# Altium schematic sheet v3s.SchDoc
size B
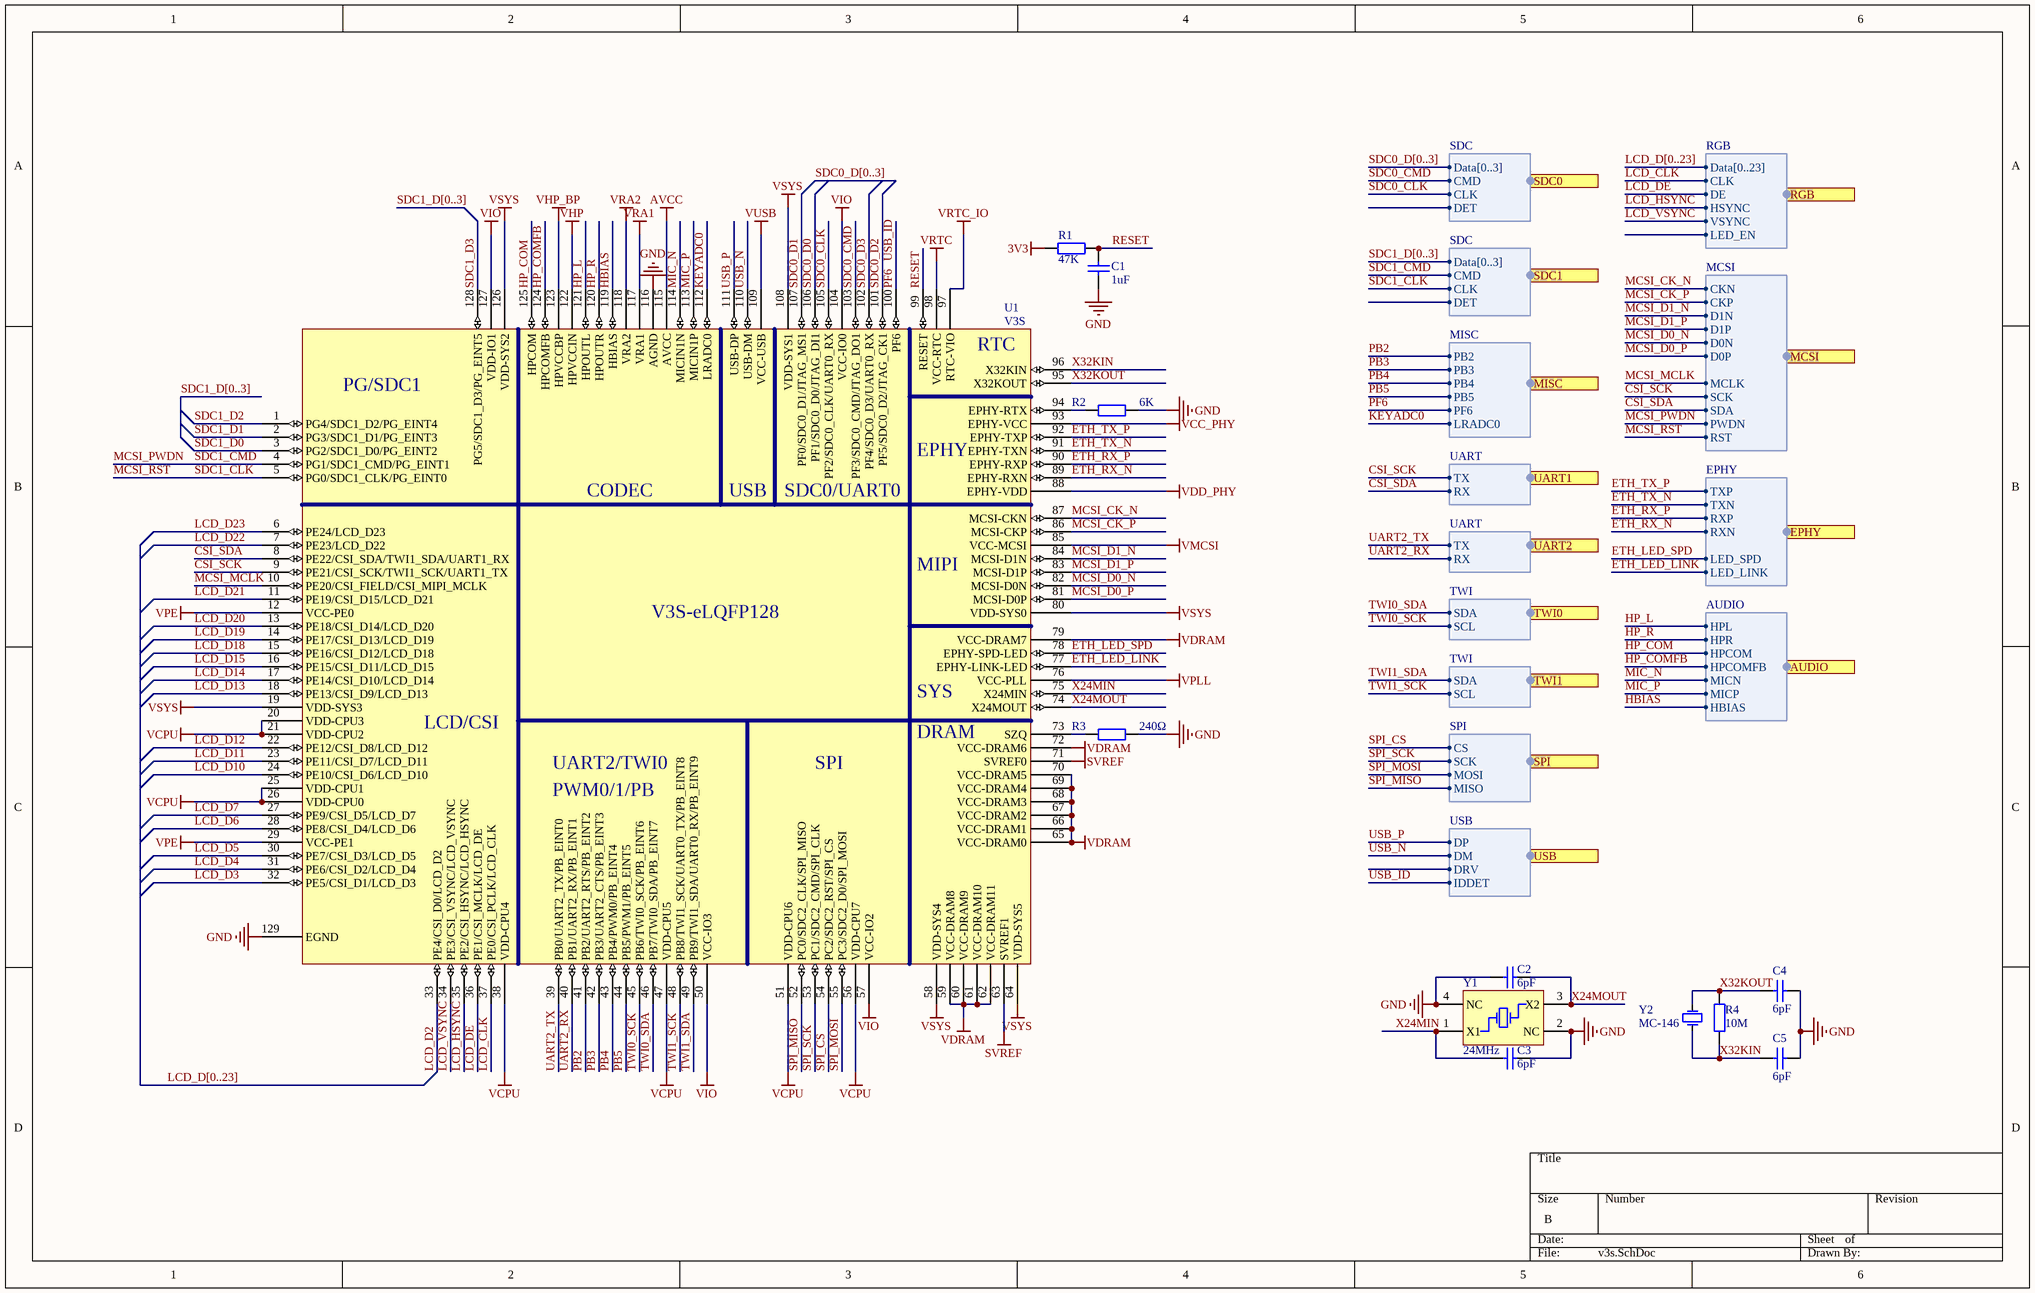
[diagram p0: v3s.SchDoc]

## Parts
C1  1uF  [CAPC1608L]
C2  6pF  [CAPC1608L]
C3  6pF  [CAPC1608L]
C4  6pF  [CAPC1608L]
C5  6pF  [CAPC1608L]
R1  47K  [RESC1608L]
R2  6K  [RESC1608L]
R3  240Ω  [RESC1608L]
R4  10M  [RESC1608L]
U1  V3S  [V3S_L]
Y1  24MHz  [XTAL-3225]
Y2  MC-146  [MC-146]

## Ports
AUDIO (harness AUDIO), EPHY (harness EPHY), MCSI (harness MCSI), MISC (harness MISC), RGB (harness RGB), SDC0 (harness SDC), SDC1 (harness SDC), SPI (harness SPI), TWI0 (harness TWI), TWI1 (harness TWI), UART1 (harness UART), UART2 (harness UART), USB (harness USB)

## Harnesses
SDC: Data[0..3], CMD, CLK, DET
UART: TX, RX
TWI: SDA, SCL
SPI: CS, SCK, MOSI, MISO
USB: DP, DM, DRV, IDDET
RGB: Data[0..23], CLK, DE, HSYNC, VSYNC, LED_EN
MCSI: CKN, CKP, D1N, D1P, D0N, D0P, MCLK, SCK, SDA, PWDN, RST
EPHY: TXP, TXN, RXP, RXN, LED_SPD, LED_LINK
AUDIO: HPL, HPR, HPCOM, HPCOMFB, MICP, HBIAS, MICN
MISC: PB2, PB3, PB4, PB5, LRADC0, PF6

## Nets
3V3: R1.1
AVCC: U1.115(AVCC)
GND: C1.1 C2.1 C3.2 C4.2 C5.2 R2.1 R3.1 U1.116(AGND) U1.129(EGND) Y1.2(NC) Y1.4(NC)
SVREF: U1.63(SVREF1) U1.71(SVREF0)
VCC_PHY: U1.93(EPHY-VCC)
VCPU: U1.20(VDD-CPU3) U1.21(VDD-CPU2) U1.25(VDD-CPU1) U1.26(VDD-CPU0) U1.38(VDD-CPU4) U1.47(VDD-CPU5) U1.51(VDD-CPU6) U1.56(VDD-CPU7)
VDD_PHY: U1.88(EPHY-VDD)
VDRAM: U1.59(VCC-DRAM8) U1.60(VCC-DRAM9) U1.61(VCC-DRAM10) U1.62(VCC-DRAM11) U1.65(VCC-DRAM0) U1.66(VCC-DRAM1) U1.67(VCC-DRAM2) U1.68(VCC-DRAM3) U1.69(VCC-DRAM4) U1.70(VCC-DRAM5) U1.72(VCC-DRAM6) U1.79(VCC-DRAM7)
VHP: U1.122(HPVCCIN)
VHP_BP: U1.123(HPVCCBP)
VIO: U1.50(VCC-IO3) U1.57(VCC-IO2) U1.104(VCC-IO0) U1.127(VDD-IO1)
VMCSI: U1.85(VCC-MCSI)
VPE: U1.12(VCC-PE0) U1.29(VCC-PE1)
VPLL: U1.76(VCC-PLL)
VRA1: U1.117(VRA1)
VRA2: U1.118(VRA2)
VRTC: U1.98(VCC-RTC)
VRTC_IO: U1.97(RTC-VIO)
VSYS: U1.19(VDD-SYS3) U1.58(VDD-SYS4) U1.64(VDD-SYS5) U1.80(VDD-SYS0) U1.108(VDD-SYS1) U1.126(VDD-SYS2)
VUSB: U1.109(VCC-USB)
CSI_SCK: U1.9(PE21/CSI_SCK/TWI1_SCK/UART1_TX) ; port UART1.TX, port MCSI.SCK
CSI_SDA: U1.8(PE22/CSI_SDA/TWI1_SDA/UART1_RX) ; port UART1.RX, port MCSI.SDA
ETH_LED_LINK: U1.77(EPHY-LINK-LED) ; port EPHY.LED_LINK
ETH_LED_SPD: U1.78(EPHY-SPD-LED) ; port EPHY.LED_SPD
ETH_RX_N: U1.89(EPHY-RXN) ; port EPHY.RXN
ETH_RX_P: U1.90(EPHY-RXP) ; port EPHY.RXP
ETH_TX_N: U1.91(EPHY-TXN) ; port EPHY.TXN
ETH_TX_P: U1.92(EPHY-TXP) ; port EPHY.TXP
HBIAS: U1.119(HBIAS) ; port AUDIO.HBIAS
HP_COM: U1.125(HPCOM) ; port AUDIO.HPCOM
HP_COMFB: U1.124(HPCOMFB) ; port AUDIO.HPCOMFB
HP_L: U1.121(HPOUTL) ; port AUDIO.HPL
HP_R: U1.120(HPOUTR) ; port AUDIO.HPR
KEYADC0: U1.112(LRADC0) ; port MISC.LRADC0
LCD_CLK: U1.37(PE0/CSI_PCLK/LCD_CLK) ; port RGB.CLK
LCD_D2: U1.33(PE4/CSI_D0/LCD_D2)
LCD_D3: U1.32(PE5/CSI_D1/LCD_D3)
LCD_D4: U1.31(PE6/CSI_D2/LCD_D4)
LCD_D5: U1.30(PE7/CSI_D3/LCD_D5)
LCD_D6: U1.28(PE8/CSI_D4/LCD_D6)
LCD_D7: U1.27(PE9/CSI_D5/LCD_D7)
LCD_D10: U1.24(PE10/CSI_D6/LCD_D10)
LCD_D11: U1.23(PE11/CSI_D7/LCD_D11)
LCD_D12: U1.22(PE12/CSI_D8/LCD_D12)
LCD_D13: U1.18(PE13/CSI_D9/LCD_D13)
LCD_D14: U1.17(PE14/CSI_D10/LCD_D14)
LCD_D15: U1.16(PE15/CSI_D11/LCD_D15)
LCD_D18: U1.15(PE16/CSI_D12/LCD_D18)
LCD_D19: U1.14(PE17/CSI_D13/LCD_D19)
LCD_D20: U1.13(PE18/CSI_D14/LCD_D20)
LCD_D21: U1.11(PE19/CSI_D15/LCD_D21)
LCD_D22: U1.7(PE23/LCD_D22)
LCD_D23: U1.6(PE24/LCD_D23)
LCD_DE: U1.36(PE1/CSI_MCLK/LCD_DE) ; port RGB.DE
LCD_HSYNC: U1.35(PE2/CSI_HSYNC/LCD_HSYNC) ; port RGB.HSYNC
LCD_VSYNC: U1.34(PE3/CSI_VSYNC/LCD_VSYNC) ; port RGB.VSYNC
MCSI_CK_N: U1.87(MCSI-CKN) ; port MCSI.CKN
MCSI_CK_P: U1.86(MCSI-CKP) ; port MCSI.CKP
MCSI_D0_N: U1.82(MCSI-D0N) ; port MCSI.D0N
MCSI_D0_P: U1.81(MCSI-D0P) ; port MCSI.D0P
MCSI_D1_N: U1.84(MCSI-D1N) ; port MCSI.D1N
MCSI_D1_P: U1.83(MCSI-D1P) ; port MCSI.D1P
MCSI_MCLK: U1.10(PE20/CSI_FIELD/CSI_MIPI_MCLK) ; port MCSI.MCLK
MCSI_PWDN: U1.4(PG1/SDC1_CMD/PG_EINT1) ; port SDC1.CMD, port MCSI.PWDN  [also labelled SDC1_CMD]
MCSI_RST: U1.5(PG0/SDC1_CLK/PG_EINT0) ; port SDC1.CLK, port MCSI.RST  [also labelled SDC1_CLK]
MIC_N: U1.114(MICIN1N) ; port AUDIO.MICN
MIC_P: U1.113(MICIN1P) ; port AUDIO.MICP
PB2: U1.41(PB2/UART2_RTS/PB_EINT2) ; port MISC.PB2
PB3: U1.42(PB3/UART2_CTS/PB_EINT3) ; port MISC.PB3
PB4: U1.43(PB4/PWM0/PB_EINT4) ; port MISC.PB4
PB5: U1.44(PB5/PWM1/PB_EINT5) ; port MISC.PB5
PF6: U1.100(PF6) ; port USB.IDDET, port MISC.PF6  [also labelled USB_ID]
RESET: C1.2 R1.2 U1.99(RESET)
SDC0_CLK: U1.105(PF2/SDC0_CLK/UART0_RX) ; port SDC0.CLK
SDC0_CMD: U1.103(PF3/SDC0_CMD/JTAG_DO1) ; port SDC0.CMD
SDC0_D0: U1.106(PF1/SDC0_D0/JTAG_DI1)
SDC0_D1: U1.107(PF0/SDC0_D1/JTAG_MS1)
SDC0_D2: U1.101(PF5/SDC0_D2/JTAG_CK1)
SDC0_D3: U1.102(PF4/SDC0_D3/UART0_RX)
SDC1_D0: U1.3(PG2/SDC1_D0/PG_EINT2)
SDC1_D1: U1.2(PG3/SDC1_D1/PG_EINT3)
SDC1_D2: U1.1(PG4/SDC1_D2/PG_EINT4)
SDC1_D3: U1.128(PG5/SDC1_D3/PG_EINT5)
SPI_CS: U1.54(PC2/SDC2_RST/SPI_CS) ; port SPI.CS
SPI_MISO: U1.52(PC0/SDC2_CLK/SPI_MISO) ; port SPI.MISO
SPI_MOSI: U1.55(PC3/SDC2_D0/SPI_MOSI) ; port SPI.MOSI
SPI_SCK: U1.53(PC1/SDC2_CMD/SPI_CLK) ; port SPI.SCK
TWI0_SCK: U1.45(PB6/TWI0_SCK/PB_EINT6) ; port TWI0.SCL
TWI0_SDA: U1.46(PB7/TWI0_SDA/PB_EINT7) ; port TWI0.SDA
TWI1_SCK: U1.48(PB8/TWI1_SCK/UART0_TX/PB_EINT8) ; port TWI1.SCL
TWI1_SDA: U1.49(PB9/TWI1_SDA/UART0_RX/PB_EINT9) ; port TWI1.SDA
UART2_RX: U1.40(PB1/UART2_RX/PB_EINT1) ; port UART2.RX
UART2_TX: U1.39(PB0/UART2_TX/PB_EINT0) ; port UART2.TX
USB_N: U1.110(USB-DM) ; port USB.DM
USB_P: U1.111(USB-DP) ; port USB.DP
X24MIN: C3.1 U1.75(X24MIN) Y1.1(X1)
X24MOUT: C2.2 U1.74(X24MOUT) Y1.3(X2)
X32KIN: C5.1 R4.1 U1.96(X32KIN) Y2.2(OSC2)
X32KOUT: C4.1 R4.2 U1.95(X32KOUT) Y2.1(OSC1)
NetR2_2: R2.2 U1.94(EPHY-RTX)
NetR3_2: R3.2 U1.73(SZQ)

## Buses and harness runs
bus LCD_D[0..23]
bus SDC0_D[0..3]
bus SDC1_D[0..3]

## Notes on the sheet
- (in symbol V3S) RTC; PG/SDC1; EPHY; CODEC; USB; SDC0/UART0; MIPI; V3S-eLQFP128; SYS; LCD/CSI; DRAM; UART2/TWI0; SPI; PWM0/1/PB

## Library data of the parts
C1-C5 = Cap1: Capacitor; Published: 8-Jun-2000; LatestRevisionDate: 17-Jul-2002; LatestRevisionNote: Re-released for DXP Platform.; PackageReference: RAD-0.3; Publisher: Altium Limited
  C1: Value: 1uF
  C2-C5: Value: 6pF
R1-R4 = Res1: Resistor; Published: 8-Jun-2000; LatestRevisionDate: 17-Jul-2002; LatestRevisionNote: Re-released for DXP Platform.; PackageReference: AXIAL-0.4; Publisher: Altium Limited
  R1: Value: 47K
  R2: Value: 6K
  R3: Value: 240Ω
  R4: Value: 10M
U1 = V3S: 全志 ARM Cortex-A7 SoC，内置64MB DDR2
Y1 = XTAL_PASSIVE_4: Crystal Oscillator; Published: 8-Jun-2000; LatestRevisionDate: 17-Jul-2002; LatestRevisionNote: Re-released for DXP Platform.; PackageReference: R38; Publisher: Altium Limited; PackageDescription: Crystal, Thru-Hole; 2 Leads; Body 3.1 x 8.2 mm (Dia.xH)
Y2 = XTAL: Crystal Oscillator; Published: 8-Jun-2000; LatestRevisionDate: 17-Jul-2002; LatestRevisionNote: Re-released for DXP Platform.; PackageReference: R38; Publisher: Altium Limited; PackageDescription: Crystal, Thru-Hole; 2 Leads; Body 3.1 x 8.2 mm (Dia.xH)